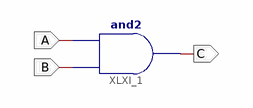
[diagram p0: schematic sheet 1]
// Xilinx ISE schematic and2.sch (spartan6) as structural Verilog: 1 symbols, 3 ports
module and2 (
  input  A,
  input  B,
  output C
);

  and XLXI_1 (C, B, A);
endmodule
